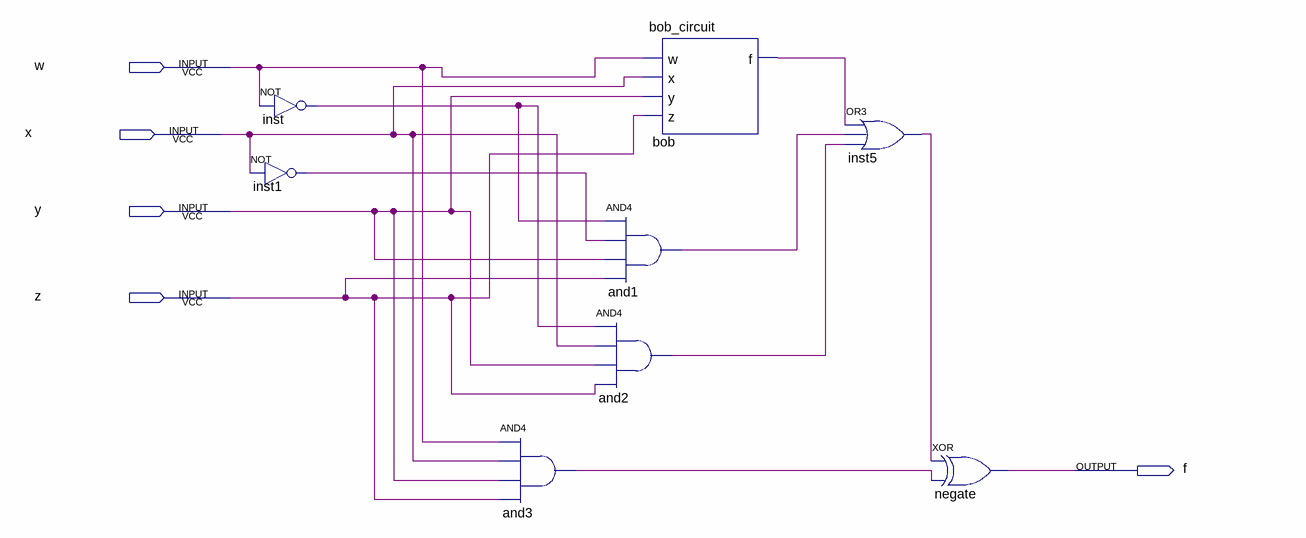
[diagram p0: schematic sheet]
// Quartus schematic final_circuit.bdf as structural Verilog: 8 symbols, 5 pins
module final_circuit (
  input  w,
  input  x,
  input  y,
  input  z,
  output f
);

  wire and1_out, and2_out, and3_out, bob_f, inst1_out, inst5_out, inst_out;

  not inst (inst_out, w);
  not inst1 (inst1_out, x);
  and and3 (and3_out, w, x, y, z);
  bob_circuit bob (.w(w), .x(x), .y(y), .z(z), .f(bob_f));
  and and1 (and1_out, inst_out, inst1_out, y, z);
  and and2 (and2_out, inst_out, x, y, z);
  or inst5 (inst5_out, bob_f, and1_out, and2_out);
  xor negate (f, inst5_out, and3_out);
endmodule
